# EAGLE design textool-2-isp (EAGLE 6.5.0)
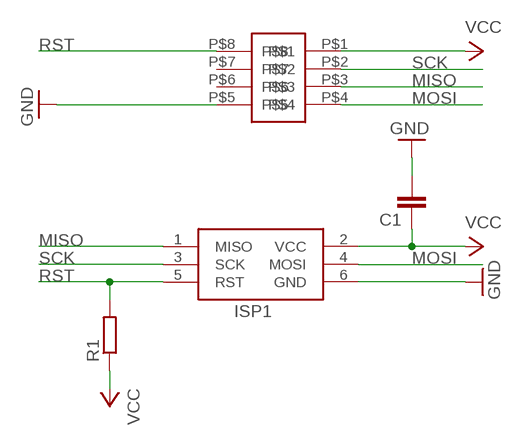
[diagram p0: schematic, sheet 1]

## Parts
C1  C-EUC0603  [C0603]
ISP1  AVRISP-6  [AVRISP]
R1  R-EU_R0603  [R0603]
U$1  TEXTOOL  [TEXTOOL]

## Nets
GND: C1.2 ISP1.6(GND) U$1.P$5
MISO: ISP1.1(MISO) U$1.P$3
MOSI: ISP1.4(MOSI) U$1.P$4
RST: ISP1.5(RST) R1.2 U$1.P$8
SCK: ISP1.3(SCK) U$1.P$2
VCC: C1.1 ISP1.2(VCC) R1.1 U$1.P$1
Unconnected: U$1.P$6 U$1.P$7

## Library data of the parts
C1 = rcl:C-EU: CAPACITOR, European symbol
ISP1 = adafruit:AVRISP: AVR ISP HEADER Standard 6 pin header for AVR programming
R1 = rcl:R-EU_: RESISTOR, European symbol
U$1 = armin:TEXTOOL

## Board
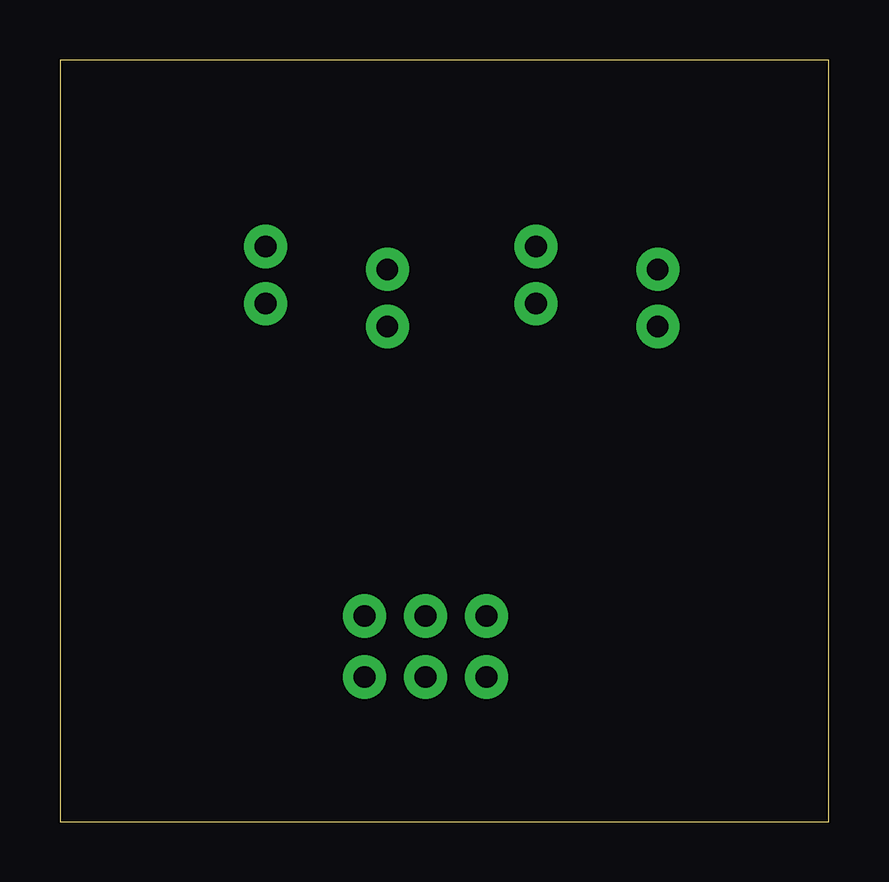
[diagram p1: board, top side]
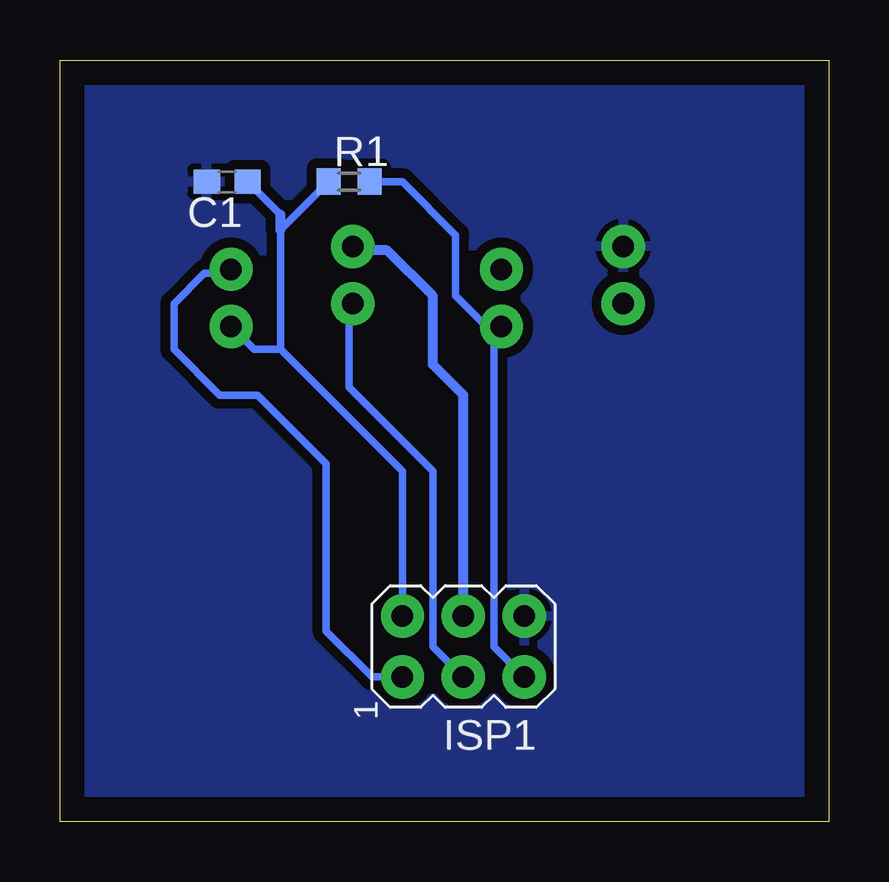
[diagram p2: board, bottom side, seen from below]

Size 32.06 x 31.74 mm. Coordinates in mm from the lower left corner, seen from the top.
Outline: 0,0 32.06,0 32.06,31.74 0,31.74 0,0
Copper layers (1*16): Top 0.035mm / dielectric 1.5mm / Bottom 0.035mm
Design rules "default *": minimum track width 10mil, minimum drill 24mil, track to track 8mil, track to pad 8mil, pad to pad 8mil, via to via 8mil, smd to smd 8mil, copper to edge 40mil, drill to drill 8mil, minimum pad ring 10mil, minimum via ring 8mil, stop-mask expansion 4mil, vias tented up to drill 0mil, thermal gap 10mil

### Footprints (pad centres in the part's own frame; a part is rotated, then mirrored left to right if it is on the bottom)
C0603 = smd 1.1 x 1: 1 -0.85,0; 2 0.85,0
AVRISP = drill 0.9 pad 1.626: 1 -1.27,2.54; 2 1.27,2.54; 3 -1.27,0; 4 1.27,0; 5 -1.27,-2.54; 6 1.27,-2.54
R0603 = smd 1 x 1.1: 1 -0.85,0; 2 0.85,0
TEXTOOL = drill 0.9: P$1 7.779,1.27; P$2 2.699,0.318; P$3 7.779,-1.111; P$4 2.699,-2.064; P$5 -8.572,-2.064; P$6 -3.493,-1.111; P$7 -8.572,0.318; P$8 -3.493,1.27

### Placement (x,y rotation side)
C1  25.08,26.67 180 bottom
ISP1  15.24,7.3 90 bottom
R1  20,26.67 0 bottom
U$1  17.14,21.91 180 bottom

### Tracks (layer width: path | path; a pad name or v marks a point on that pad's centre or on a via)
GND
  pour Bottom (isolate 0.406): -17.46,46.36 66.04,46.36 66.04,-10.16 -24.77,-10.16 -24.77,46.99
MISO
  Bottom 0.305: ISP1.1 19.05,6.03 20.96,7.94 20.96,14.92 23.81,17.78 25.4,17.78 27.31,19.69 27.31,21.59 26.04,22.86 25.08,22.86 U$1.P$3
MOSI
  Bottom 0.406: ISP1.4 15.24,17.78 16.51,19.05 16.51,21.91 18.41,23.81 19.68,23.81 U$1.P$4
RST
  Bottom 0.305: ISP1.5 13.97,7.3 13.97,20.32 | 14.29,20.64 15.56,21.91 15.56,24.45 17.78,26.67 R1.2
  Bottom 0.406: 13.97,20.32 U$1.P$8 14.29,20.64
SCK
  Bottom 0.305: ISP1.3 16.51,7.3 16.51,14.6 20,18.1 20,21.43
  Bottom 0.406: 20,21.43 U$1.P$2
VCC
  Bottom 0.305: ISP1.2 17.78,14.6 22.86,19.69 | 22.86,19.69 23.97,19.69 U$1.P$1 | 22.86,19.69 22.86,24.66 R1.1 | 22.86,25.3 C1.1
  Bottom 0.406: 22.86,24.66 22.86,25.3